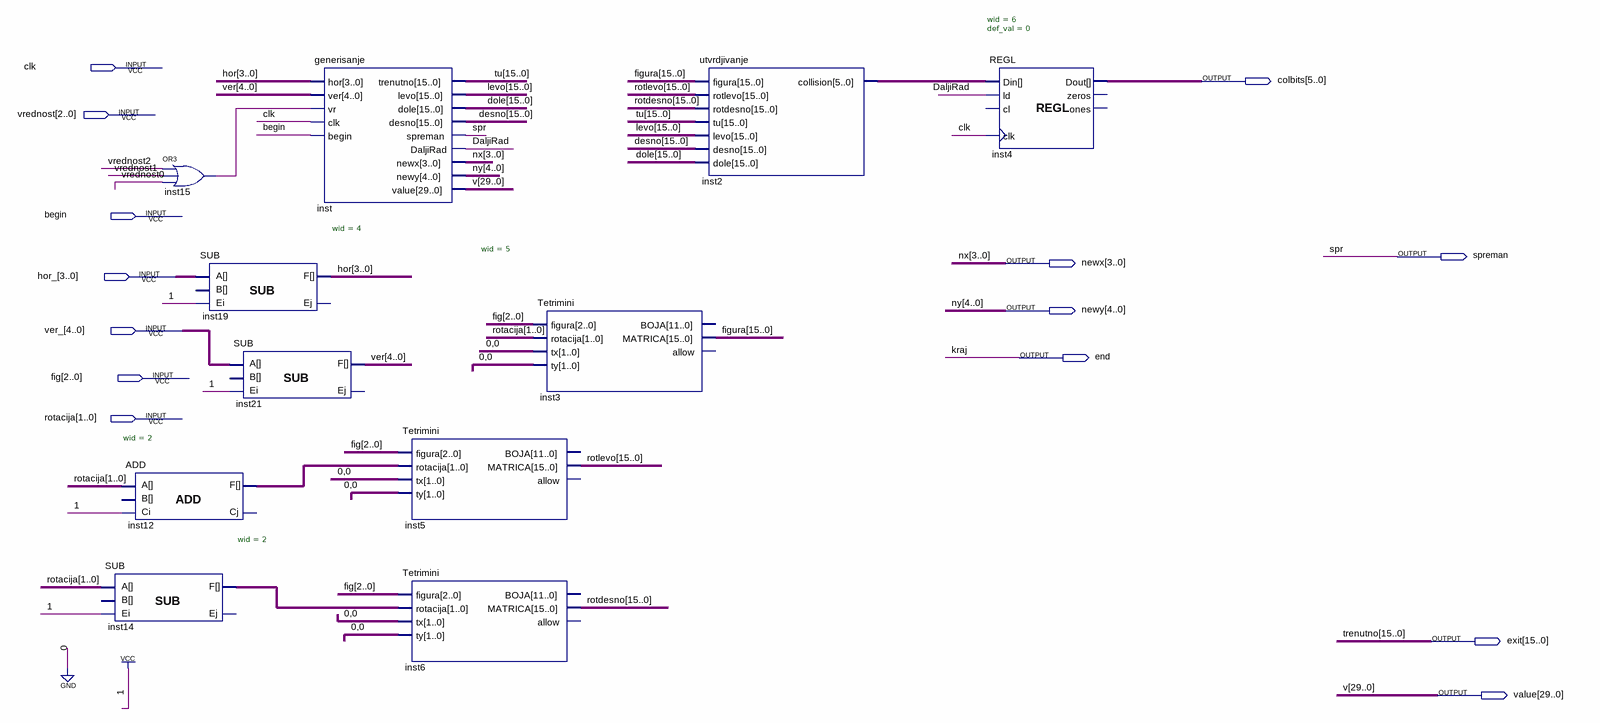
[diagram p0: schematic sheet]
// Quartus schematic kolizije.bdf as structural Verilog: 11 symbols, 14 pins
module kolizije (
  input  clk,
  input  [2:0] vrednost,
  input  \begin ,
  input  [3:0] hor_,
  input  [4:0] ver_,
  input  [2:0] fig,
  input  [1:0] rotacija,
  output [5:0] colbits,
  output spreman,
  output [3:0] newx,
  output [4:0] newy,
  output \end ,
  output [15:0] exit,
  output [29:0] value
);

  wire DaljiRad, inst15_out;
  wire [1:0] inst12_f, inst14_f;
  wire [3:0] hor;
  wire [4:0] ver;
  wire [5:0] inst2_collision;
  wire [15:0] desno, dole, figura, levo, rotdesno, rotlevo, tu;

  ADD #(.wid(2)) inst12 (.A(rotacija), .Ci(1'b1), .F(inst12_f));  // open: B, Cj
  SUB #(.wid(2)) inst14 (.A(rotacija), .Ei(1'b1), .F(inst14_f));  // open: B, Ej
  or inst15 (inst15_out, vrednost[2], vrednost[1], vrednost[0]);
  SUB #(.wid(4)) inst19 (.A(hor_), .Ei(1'b1), .F(hor));  // open: B, Ej
  SUB #(.wid(5)) inst21 (.A(ver_), .Ei(1'b1), .F(ver));  // open: B, Ej
  generisanje inst (
    .hor(hor), .ver(ver), .vr(inst15_out), .clk(clk), .\begin (\begin ), .trenutno(tu), .levo(levo),
    .dole(dole), .desno(desno), .spreman(spreman), .DaljiRad(DaljiRad), .newx(newx), .newy(newy),
    .value(value));
  Tetrimini inst5 (.figura(fig), .rotacija(inst12_f), .tx(2'b00), .ty(2'b00), .MATRICA(rotlevo));  // open: BOJA, allow
  Tetrimini inst6 (.figura(fig), .rotacija(inst14_f), .tx(2'b00), .ty(2'b00), .MATRICA(rotdesno));  // open: BOJA, allow
  Tetrimini inst3 (.figura(fig), .rotacija(rotacija), .tx(2'b00), .ty(2'b00), .MATRICA(figura));  // open: BOJA, allow
  utvrdjivanje inst2 (
    .figura(figura), .rotlevo(rotlevo), .rotdesno(rotdesno), .tu(tu), .levo(levo), .desno(desno),
    .dole(dole), .collision(inst2_collision));
  REGL #(.wid(6), .def_val(0)) inst4 (
    .Din(inst2_collision), .ld(DaljiRad), .clk(clk), .Dout(colbits));  // open: cl, zeros, ones

  // Other names for the same wires on the sheet: kraj = \end ; nx[3:0] = newx; ny[4:0] = newy; spr = spreman;
  //   trenutno[15:0] = exit; v[29:0] = value
endmodule
